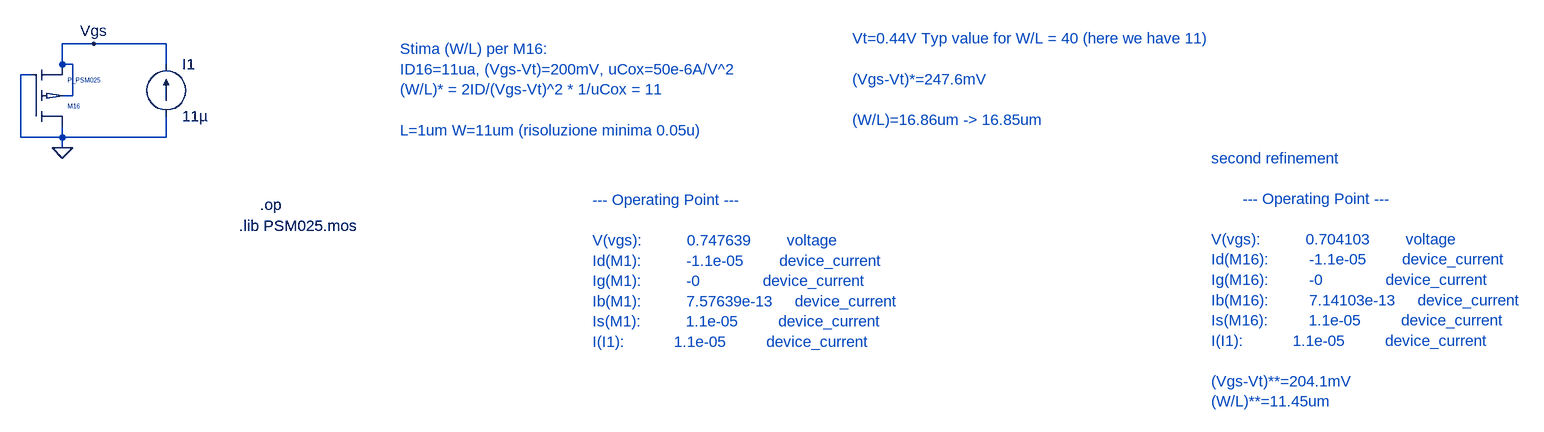
[diagram p0: schematic WL_estimation_pmos.asc]
WL_estimation_pmos.asc, the LTspice schematic file:
Version 4
SHEET 1 2452 680
WIRE 208 80 160 80
WIRE 320 80 208 80
WIRE 160 112 160 80
WIRE 176 112 160 112
WIRE 320 112 320 80
WIRE 112 128 96 128
WIRE 176 160 176 112
WIRE 176 160 160 160
WIRE 96 224 96 128
WIRE 160 224 160 208
WIRE 160 224 96 224
WIRE 320 224 320 192
WIRE 320 224 160 224
WIRE 160 240 160 224
FLAG 160 240 0
FLAG 208 80 Vgs
SYMBOL current 320 192 M180
WINDOW 0 24 80 Left 2
WINDOW 3 24 0 Left 2
WINDOW 123 0 0 Left 0
WINDOW 39 0 0 Left 0
SYMATTR InstName I1
SYMATTR Value 11µ
SYMBOL P_PSM025 112 208 M180
SYMATTR InstName M16
SYMATTR Value2 l=1u w=16.85u
TEXT 680 88 Left 2 ;Stima (W/L) per M16:\nID16=11ua, (Vgs-Vt)=200mV, uCox=50e-6A/V^2\n(W/L)* = 2ID/(Vgs-Vt)^2 * 1/uCox = 11\n \nL=1um W=11um (risoluzione minima 0.05u)
TEXT 464 328 Left 2 !.op
TEXT 432 360 Left 2 !.lib PSM025.mos
TEXT 1376 72 Left 2 ;Vt=0.44V Typ value for W/L = 40 (here we have 11)\n \n(Vgs-Vt)*=247.6mV\n \n(W/L)=16.86um -> 16.85um
TEXT 976 320 Left 2 ;--- Operating Point ---\n \nV(vgs):          0.747639        voltage\nId(M1):          -1.1e-05        device_current\nIg(M1):          -0              device_current\nIb(M1):          7.57639e-13     device_current\nIs(M1):          1.1e-05         device_current\nI(I1):           1.1e-05         device_current
TEXT 1928 256 Left 2 ;second refinement\n \n       --- Operating Point ---\n \nV(vgs):          0.704103        voltage\nId(M16):         -1.1e-05        device_current\nIg(M16):         -0              device_current\nIb(M16):         7.14103e-13     device_current\nIs(M16):         1.1e-05         device_current\nI(I1):           1.1e-05         device_current\n \n(Vgs-Vt)**=204.1mV\n(W/L)**=11.45um

The netlist it stands for:
* WL_estimation_pmos.asc
I1 0 Vgs 11µ
M16 0 0 Vgs Vgs P_PSM025 l=1u w=16.85u
.model NMOS NMOS
.model PMOS PMOS
.lib standard.mos
* Stima (W/L) per M16:
* ID16=11ua, (Vgs-Vt)=200mV, uCox=50e-6A/V^2
* (W/L)* = 2ID/(Vgs-Vt)^2 * 1/uCox = 11
* L=1um W=11um (risoluzione minima 0.05u)
.op
.lib PSM025.mos
* Vt=0.44V Typ value for W/L = 40 (here we have 11)
* (Vgs-Vt)*=247.6mV
* (W/L)=16.86um -> 16.85um
* --- Operating Point ---
* V(vgs):          0.747639        voltage
* Id(M1):          -1.1e-05        device_current
* Ig(M1):          -0              device_current
* Ib(M1):          7.57639e-13     device_current
* Is(M1):          1.1e-05         device_current
* I(I1):           1.1e-05         device_current
* second refinement
*        --- Operating Point ---
* V(vgs):          0.704103        voltage
* Id(M16):         -1.1e-05        device_current
* Ig(M16):         -0              device_current
* Ib(M16):         7.14103e-13     device_current
* Is(M16):         1.1e-05         device_current
* I(I1):           1.1e-05         device_current
* (Vgs-Vt)**=204.1mV
* (W/L)**=11.45um
.backanno
.end